# Altium project Motor Supervisor.PrjPCB
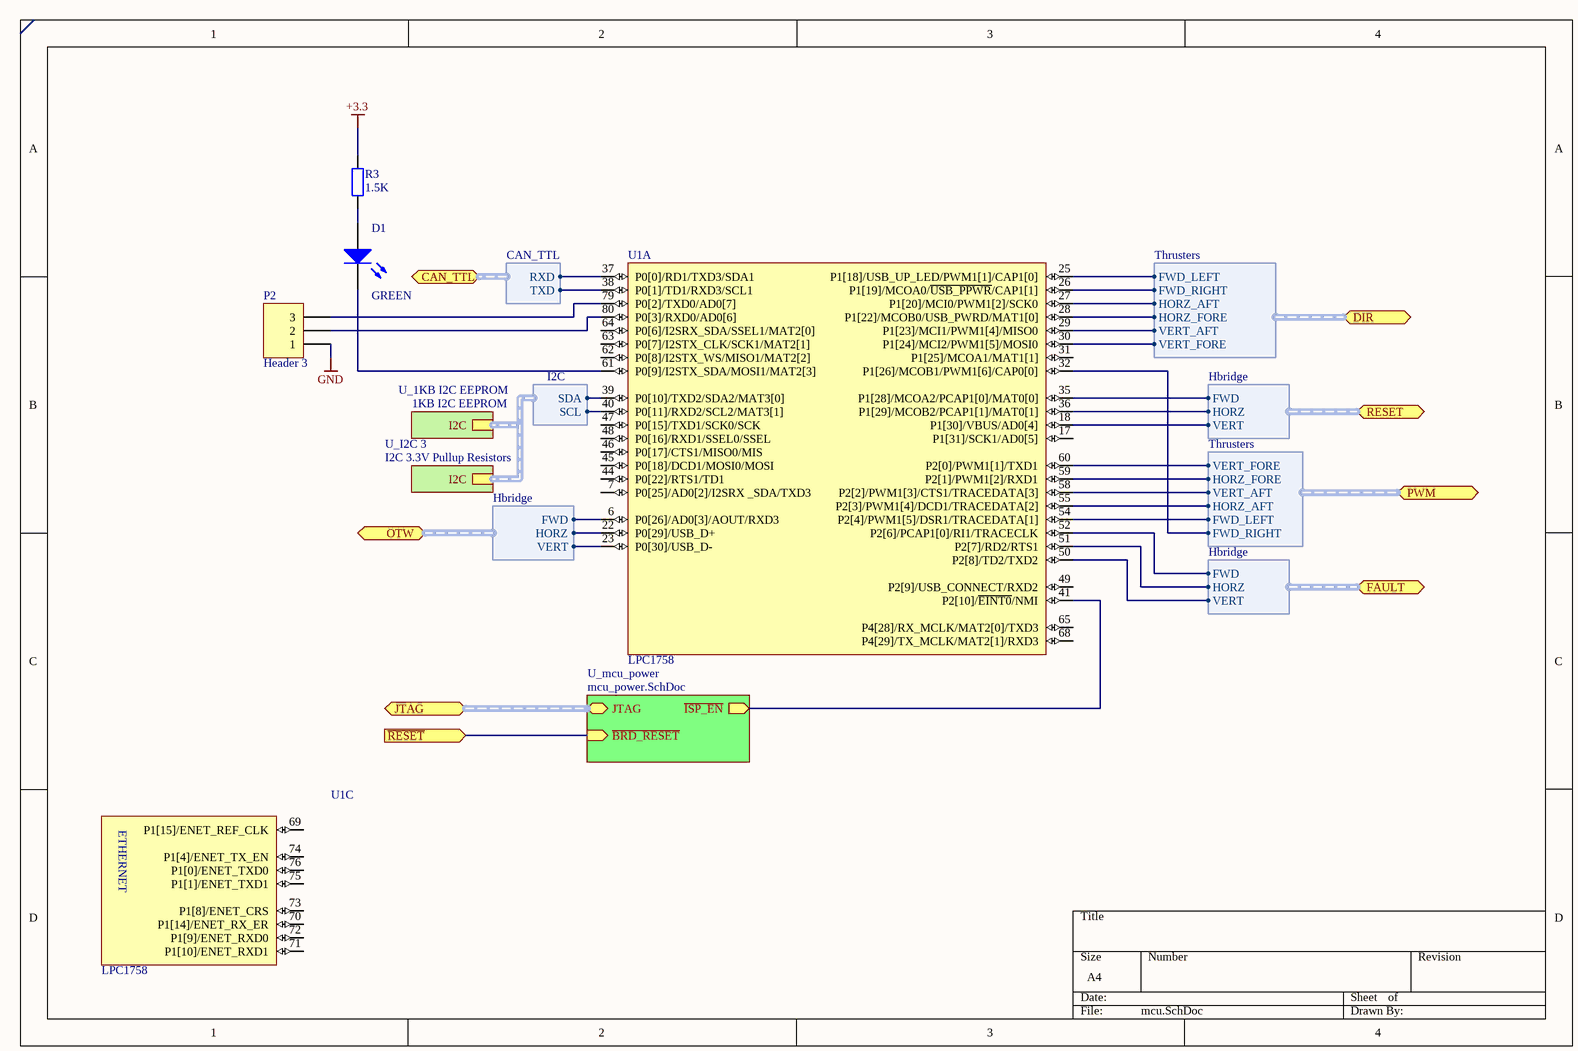
[diagram p0: mcu.SchDoc]
2 sheets, 5 parts. Net scope: hierarchical (ports join the sheet entries above them; power ports are global).
Board file: msb.PcbDoc
Sheets:
  mcu.SchDoc
  motor_output.SchDoc

## Sheet mcu.SchDoc
size A4

### Parts
D1  value GREEN  [LGQ971]
P2  Header 3  [HDR1X3]
R3  value 1.5K  [R0603]  (hidden comment: Res)
U1  LPC1758  [LPC1758FBD80]  (parts A,C of 3)

### Sub-sheets
U_1KB I2C EEPROM = 1KB I2C EEPROM (file not in this document): I2C (harness I2C)
U_I2C 3 = I2C 3.3V Pullup Resistors (file not in this document): I2C (harness I2C)
U_mcu_power = mcu_power.SchDoc (file not in this document): JTAG (harness ARM_JTAG), ~{ISP_EN} (out), ~{BRD_RESET} (in)

### Ports
CAN_TTL (harness CAN_TTL), DIR (harness Thrusters), FAULT (harness Hbridge), JTAG (harness ARM_JTAG), OTW (harness Hbridge), PWM (harness Thrusters), RESET (harness Hbridge), ~{RESET} (in)

### Harnesses
CAN_TTL: RXD, TXD
I2C: SCL, SDA
Thrusters: VERT_FORE, HORZ_FORE, VERT_AFT, HORZ_AFT, FWD_LEFT, FWD_RIGHT
Thrusters: FWD_LEFT, FWD_RIGHT, HORZ_AFT, HORZ_FORE, VERT_AFT, VERT_FORE
Hbridge: FWD, HORZ, VERT

### Nets
+3.3: R3.2
GND: P2.1
~{RESET}: port ~{RESET}, sheet U_mcu_power/~{BRD_RESET}
NetD1_1: D1.1(A) R3.1
NetD1_2: D1.2(K) U1.61(P0[9]/I2STX_SDA/MOSI1/MAT2[3])
NetP2_2: P2.2 U1.80(P0[3]/RXD0/AD0[6])
NetP2_3: P2.3 U1.79(P0[2]/TXD0/AD0[7])
NetU1_6: U1.6(P0[26]/AD0[3]/AOUT/RXD3) ; port OTW.FWD
NetU1_18: U1.18(P1[30]/VBUS/AD0[4]) ; port RESET.VERT
NetU1_22: U1.22(P0[29]/USB_D+) ; port OTW.HORZ
NetU1_23: U1.23(P0[30]/USB_D-) ; port OTW.VERT
NetU1_25: U1.25(P1[18]/USB_UP_LED/PWM1[1]/CAP1[0]) ; port DIR.FWD_LEFT
NetU1_26: U1.26(P1[19]/MCOA0/~{USB_PPWR}/CAP1[1]) ; port DIR.FWD_RIGHT
NetU1_27: U1.27(P1[20]/MCI0/PWM1[2]/SCK0) ; port DIR.HORZ_AFT
NetU1_28: U1.28(P1[22]/MCOB0/USB_PWRD/MAT1[0]) ; port DIR.HORZ_FORE
NetU1_29: U1.29(P1[23]/MCI1/PWM1[4]/MISO0) ; port DIR.VERT_AFT
NetU1_30: U1.30(P1[24]/MCI2/PWM1[5]/MOSI0) ; port DIR.VERT_FORE
NetU1_32: U1.32(P1[26]/MCOB1/PWM1[6]/CAP0[0]) ; port PWM.FWD_RIGHT
NetU1_35: U1.35(P1[28]/MCOA2/PCAP1[0]/MAT0[0]) ; port RESET.FWD
NetU1_36: U1.36(P1[29]/MCOB2/PCAP1[1]/MAT0[1]) ; port RESET.HORZ
NetU1_37: U1.37(P0[0]/RD1/TXD3/SDA1) ; port CAN_TTL.RXD
NetU1_38: U1.38(P0[1]/TD1/RXD3/SCL1) ; port CAN_TTL.TXD
NetU1_39: U1.39(P0[10]/TXD2/SDA2/MAT3[0]) ; sheet U_1KB I2C EEPROM/I2C.SDA
NetU1_40: U1.40(P0[11]/RXD2/SCL2/MAT3[1]) ; sheet U_1KB I2C EEPROM/I2C.SCL
NetU1_41: U1.41(P2[10]/~{EINT0}/NMI) ; sheet U_mcu_power/~{ISP_EN}
NetU1_50: U1.50(P2[8]/TD2/TXD2) ; port FAULT.VERT
NetU1_51: U1.51(P2[7]/RD2/RTS1) ; port FAULT.HORZ
NetU1_52: U1.52(P2[6]/PCAP1[0]/RI1/TRACECLK) ; port FAULT.FWD
NetU1_54: U1.54(P2[4]/PWM1[5]/DSR1/TRACEDATA[1]) ; port PWM.FWD_LEFT
NetU1_55: U1.55(P2[3]/PWM1[4]/DCD1/TRACEDATA[2]) ; port PWM.HORZ_AFT
NetU1_58: U1.58(P2[2]/PWM1[3]/CTS1/TRACEDATA[3]) ; port PWM.VERT_AFT
NetU1_59: U1.59(P2[1]/PWM1[2]/RXD1) ; port PWM.HORZ_FORE
NetU1_60: U1.60(P2[0]/PWM1[1]/TXD1) ; port PWM.VERT_FORE

Not connected (* = marked no-connect by the designer): U1 7(P0[25]/AD0[2]/I2SRX__SDA/TXD3) 17(P1[31]/SCK1/AD0[5]) 31(P1[25]/MCOA1/MAT1[1]) 44(P0[22]/RTS1/TD1) 45(P0[18]/DCD1/MOSI0/MOSI) 46(P0[17]/CTS1/MISO0/MIS) 47(P0[15]/TXD1/SCK0/SCK) 48(P0[16]/RXD1/SSEL0/SSEL) 49(P2[9]/USB_CONNECT/RXD2) 62(P0[8]/I2STX_WS/MISO1/MAT2[2]) 63(P0[7]/I2STX_CLK/SCK1/MAT2[1]) 64(P0[6]/I2SRX_SDA/SSEL1/MAT2[0]) 65(P4[28]/RX_MCLK/MAT2[0]/TXD3) 68(P4[29]/TX_MCLK/MAT2[1]/RXD3) 69(P1[15]/ENET_REF_CLK) 70(P1[14]/ENET_RX_ER) 71(P1[10]/ENET_RXD1) 72(P1[9]/ENET_RXD0) 73(P1[8]/ENET_CRS) 74(P1[4]/ENET_TX_EN) 75(P1[1]/ENET_TXD1) 76(P1[0]/ENET_TXD0)

### Buses and harness runs
harness port JTAG = sheet U_mcu_power/JTAG
harness sheet U_1KB I2C EEPROM/I2C = sheet U_I2C 3/I2C

### Notes on the sheet
- (in symbol LPC1758, part C) ETHERNET

### Library data of the parts
D1 = LED2: Typical RED, GREEN, YELLOW, AMBER GaAs LED; farnell: 1226372
P2 = Header 3: Header, 3-Pin; LatestRevisionDate: 17-Jul-2002; LatestRevisionNote: Re-released for DXP Platform.; Publisher: Altium Limited
R3 = Res2: Resistor; farnell: 9330607
U1 = LPC1758: NXP - LPC1758FBD80 - MCU, 32BIT, ARM CORTEX M3, 80LQFP; farnell: 1718545

## Sheet motor_output.SchDoc
size A4
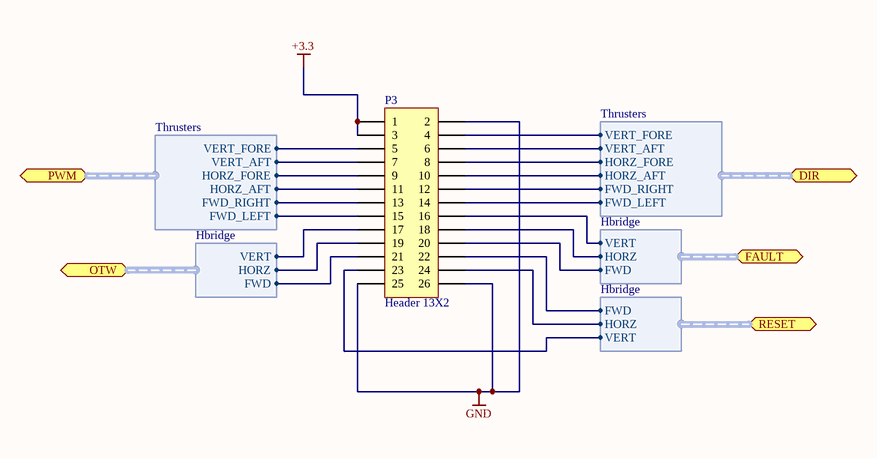
[diagram p1: motor_output.SchDoc]

### Parts
P3  Header 13X2  [HDR2X13]

### Ports
DIR (harness Thrusters), FAULT (harness Hbridge), OTW (harness Hbridge), PWM (harness Thrusters), RESET (harness Hbridge)

### Harnesses
Thrusters: FWD_LEFT, FWD_RIGHT, HORZ_AFT, HORZ_FORE, VERT_AFT, VERT_FORE
Hbridge: VERT, HORZ, FWD
Hbridge: FWD, HORZ, VERT

### Nets
+3.3: P3.1 P3.3
GND: P3.2 P3.25 P3.26
NetP3_4: P3.4 ; port DIR.VERT_FORE
NetP3_5: P3.5 ; port PWM.VERT_FORE
NetP3_6: P3.6 ; port DIR.VERT_AFT
NetP3_7: P3.7 ; port PWM.VERT_AFT
NetP3_8: P3.8 ; port DIR.HORZ_FORE
NetP3_9: P3.9 ; port PWM.HORZ_FORE
NetP3_10: P3.10 ; port DIR.HORZ_AFT
NetP3_11: P3.11 ; port PWM.HORZ_AFT
NetP3_12: P3.12 ; port DIR.FWD_RIGHT
NetP3_13: P3.13 ; port PWM.FWD_RIGHT
NetP3_14: P3.14 ; port DIR.FWD_LEFT
NetP3_15: P3.15 ; port PWM.FWD_LEFT
NetP3_16: P3.16 ; port FAULT.VERT
NetP3_17: P3.17 ; port OTW.VERT
NetP3_18: P3.18 ; port FAULT.HORZ
NetP3_19: P3.19 ; port OTW.HORZ
NetP3_20: P3.20 ; port FAULT.FWD
NetP3_21: P3.21 ; port OTW.FWD
NetP3_22: P3.22 ; port RESET.FWD
NetP3_23: P3.23 ; port RESET.VERT
NetP3_24: P3.24 ; port RESET.HORZ

### Library data of the parts
P3 = Header 13X2: Header, 13-Pin, Dual row; LatestRevisionDate: 17-Jul-2002; LatestRevisionNote: Re-released for DXP Platform.; Publisher: Altium Limited

## Nets that join several sheets
+3.3: mcu (R3.2), motor_output (P3.1 P3.3)
GND: mcu (P2.1), motor_output (P3.2 P3.25 P3.26)